# Altium schematic sheet Battery_1CELL.SchDoc
size A4
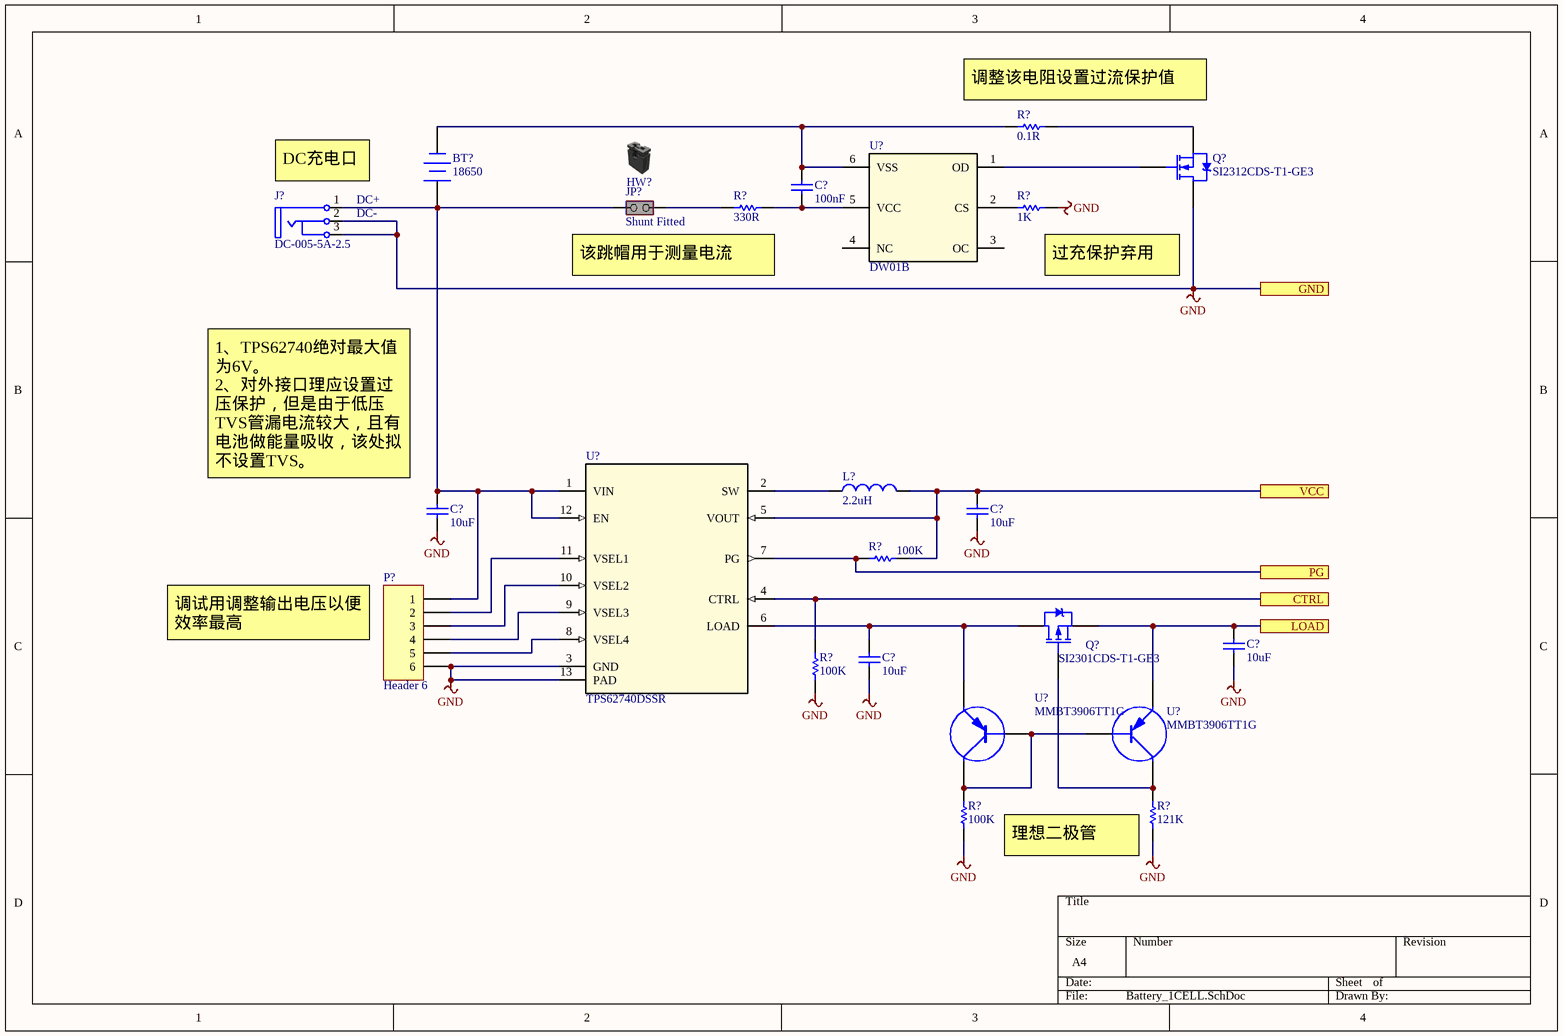
[diagram p0: Battery_1CELL.SchDoc]

## Parts
(Parts that share a designator on the sheet are numbered #1, #2 ... from top to bottom, then left to right.)
BT?  18650  [DIP-18650]
C?#1  100nF  [S0603C]
C?#2  10uF  [S0805C]
C?#3  10uF  [S0805C]
C?#4  10uF  [S0805C]
C?#5  10uF  [S0805C]
HW?  SHUNT  (value not drawn)  (mechanical)
J?  DC-005-5A-2.5  [DC-5.5X2.5]
JP?  Shunt Fitted  [CON_SAMTEC_TSW-102-07-G-S]
L?  2.2uH  [S0805L]
P?  Header 6  [CP1X6]
Q?#1  SI2312CDS-T1-GE3  [SOT-23(SOT-23-3)]
Q?#2  SI2301CDS-T1-GE3  [SOT-23(SOT-23-3)]
R?#1  0.1R  [S0805R]
R?#2  330R  [S0603R]
R?#3  1K  [S0603R]
R?#4  100K  [S0603R]
R?#5  100K  [S0603R]
R?#6  100K  [S0603R]
R?#7  121K  [S0603R]
U?#1  DW01B  [USOT23-6]
U?#2  TPS62740DSSR  [DSS0012A]
U?#3  MMBT3906TT1G  [SOT-23(SOT-23-3)]
U?#4  MMBT3906TT1G  [SOT-23(SOT-23-3)]

## Ports
CTRL, GND, LOAD, PG, VCC

## Nets
GND: C?#2.1 C?#3.1 C?#4.1 C?#5.1 J?.2(DC-) J?.3(DC-) P?.6 Q?#1.3(D) R?#3.2 R?#5.1 R?#6.1 R?#7.1 U?#2.3(GND) U?#2.13(PAD) ; port GND
CTRL: R?#5.2 U?#2.4(CTRL) ; port CTRL
LOAD: C?#4.2 Q?#2.2(S) U?#4.2(E) ; port LOAD
PG: R?#4.1 U?#2.7(PG) ; port PG
VCC: C?#3.2 L?.2 R?#4.2 U?#2.5(VOUT) ; port VCC
NetBT?_1: BT?.1(+) C?#2.2 J?.1(DC+) JP?.1(COMMON) P?.1 U?#2.1(VIN) U?#2.12(EN)
NetBT?_2: BT?.2(-) C?#1.1 R?#1.1 U?#1.6(VSS)
NetC?#1_2: C?#1.2 R?#2.2 U?#1.5(VCC)
NetC?#5_2: C?#5.2 Q?#2.3(D) U?#2.6(LOAD) U?#3.2(E)
NetJP?_2: JP?.2(NO) R?#2.1
NetL?_1: L?.1 U?#2.2(SW)
NetP?_2: P?.2 U?#2.11(VSEL1)
NetP?_3: P?.3 U?#2.10(VSEL2)
NetP?_4: P?.4 U?#2.9(VSEL3)
NetP?_5: P?.5 U?#2.8(VSEL4)
NetQ?#1_1: Q?#1.1(G) U?#1.1(OD)
NetQ?#1_2: Q?#1.2(S) R?#1.2
NetQ?#2_1: Q?#2.1(G) R?#7.2 U?#4.3(C)
NetR?#3_1: R?#3.1 U?#1.2(CS)
NetR?#6_2: R?#6.2 U?#3.1(B) U?#3.3(C) U?#4.1(B)

Not connected (* = marked no-connect by the designer): U?#1 3(OC) 4(NC)

## Notes on the sheet
- (near R?#1) 调整该电阻设置过流保护值
- (near J?) DC充电口
- (near J?) DC+
- (near J?) DC-
- 该跳帽用于测量电流
- (near R?#3) 过充保护弃用
- (near C?#2) 1、TPS62740绝对最大值为6V。
  2、对外接口理应设置过压保护，但是由于低压TVS管漏电流较大，且有电池做能量吸收，该处拟不设置TVS。
- 调试用调整输出电压以便效率最高
- (near R?#7) 理想二极管

## Library data of the parts
BT? = Battery_18650_DIP: 18650单节直插电池仓; CompType: 电池盒/电池座; Code: DIP-18650; DistributorCode: -; Manufacturer: -; Package: DIP; A_Code: -; A_ComType: -; A_Manufacturer: -
C?#1 = 100nF/0603/50V: 精度 ±10% / 容值 100nF / 额定电压 50V / 温漂系数（介质材料) X7R; Manufacturer: FH(风华); A_Manufacturer: 元六; Code: 0603B104K500NT; A_Code: J CT41-0603-2R1-50V-104K; CompType: Capacitor; A_ComType: 二类电容; DistributorCode: C30926; Package: 0603
C?#2-C?#5 = 10uF/0805/16V: 精度 ±10% / 容值 10uF / 额定电压 16V / 温漂系数（介质材料) X7R; Manufacturer: FH(风华); A_Manufacturer: 元六; Code: 0805B106K160NT; CompType: Capacitor; A_Code: J CT41-0805-2R2-16V-106M; A_ComType: 二类电容; Package: 0805; DistributorCode: C92341
HW? = SHUNT: SHUNT 2.54mm BLACK; Internal_Part_Number: MCD-00043; Manufacturer_Part_Number: SNT-100-BK-G; Manufacturer: SAMTEC; Part_Type: Mechanical; Provided_By: Subcon; Initial_Board_Reference: MB1274; ECCN_US: n/a; ECCN_EU: n/a; ComponentLink1Description: Samtec_Shunt_Jumper_SNT100.pdf; Status: Released; ComponentLink1URL: http://tunmcdsvn.tun.st.com/Component_Datasheet_Library/Trunk/Connectors/Samtec_Shunt_Jumper_SNT100
J? = DC-005-5A-2.5: 连接器类型 插孔 / 触点外径 6.5mm / 安装特性 - / 电流额定值 5A / 产品类型 DC电源插座 / 公母 公头 / 安装类型 通孔，直角 / 触点内径 2.5mm / 电压额定值 24V; Manufacturer: XKB Connectivity(中国星坤); CompType: 连接器; Code: DC-005-5A-2.5; DistributorCode: C381115; Package: DC电源插座; A_Code: -; A_ComType: -; A_Manufacturer: -
JP? = MCD-00683: Header, 2x1, 2,54mm, VR, TH, Height 5.84mm/2.54mm - Shunt Fitted by default; Part_Type: Connector; Manufacturer_Part_Number: TSW-102-07-x-S; Manufacturer: SAMTEC; Provided_By: Subcon; Initial_Board_Reference: MB1331; Internal_Part_Number: MCD-00683; Status: Released; ComponentLink1Description: Samtec_connector_TSW-HTSW-series.pdf; ComponentLink1URL: http://tunmcdsvn.tun.st.com/Component_Datasheet_Library/Trunk/Connectors/Samtec_TSW-HTSW-series; ECCN_US: n/a; ECCN_EU: n/a; Value: Shunt Fitted
L? = 2.2uH/0805: 精度 ±20% / 额定电流 800mA / 直流电阻（内阻） 230mΩ / 电感值 2.2uH; Manufacturer: TDK; A_Manufacturer: 振华富; Code: MLP2012S2R2MT0S1; A_Code: PI2012F2R2; CompType: Inductor; DistributorCode: C107322; Package: 0805; A_ComType: -
P? = Header 6: Header, 6-Pin; LatestRevisionDate: 17-Jul-2002; LatestRevisionNote: Re-released for DXP Platform.; Publisher: Altium Limited
Q?#1 = SI2312CDS-T1-GE3: 漏源电压（Vdss） 20V / 连续漏极电流（Id）（25°C 时） 6A(Tc) / 栅源极阈值电压 1V @ 250uA / 漏源导通电阻 31.8mΩ @ 5A,4.5V / 最大功率耗散（Ta=25°C） 2.1W(Tc) / 类型 N沟道; Manufacturer: VISHAY(威世); CompType: MOS(场效应管); A_Code: -; A_Manufacturer: -; Code: SI2312CDS-T1-GE3; DistributorCode: C142518; Package: SOT-23-3; A_ComType: -
Q?#2 = SI2301CDS-T1-GE3: 漏源电压（Vdss） -20V / 连续漏极电流（Id）（25°C 时） 3.1A / 栅源极阈值电压 1V @ 250uA / 漏源导通电阻 112mΩ @ 2.8A,4.5V / 最大功率耗散（Ta=25°C） 860mW / 类型 P沟道; Manufacturer: VISHAY(威世); CompType: MOS(场效应管); A_Code: -; A_Manufacturer: -; Code: SI2301CDS-T1-GE3; DistributorCode: C10487; Package: SOT-23-3; A_ComType: -
R?#1 = 0.1R/0805: 阻值（欧姆） 0.1Ω / 精度 ±1% / 功率 1/3W / 温度系数 ±100ppm/°C; Manufacturer: UNI-ROYAL(厚声); A_Manufacturer: 718; Code: HP05W3F100LT5E; A_Code: J-RM2012(0805)-K-B-0.1R-F; CompType: Resistor; A_ComType: RM型片式膜固定电阻器; DistributorCode: C270842; Package: 0805
R?#2 = 330R/0603: 精度 ±1% / 温度系数 ±100ppm/℃ / 阻值 330Ω / 功率 0.1W; Manufacturer: FH(风华); A_Manufacturer: 718; Code: RS-03K3300FT; A_Code: J-RM1608(0603)-K-B-330R-F; CompType: Resistor; A_ComType: RM型片式膜固定电阻器; DistributorCode: C125768; Package: 0603
R?#3 = 1K/0603: 精度 ±1% / 温度系数 ±100ppm/℃ / 阻值 1kΩ / 功率 0.1W; Manufacturer: FH(风华); A_Manufacturer: 718; Code: RS-03K1001FT; A_Code: J-RM1608(0603)-K-B-1K-F; CompType: Resistor; A_ComType: RM型片式膜固定电阻器; DistributorCode: C115325; Package: 0603
R?#4-R?#6 = 100K/0603: 精度 ±1% / 阻值 100kΩ / 温度系数 ±100ppm/℃ / 功率 0.1W; Manufacturer: FH(风华); A_Manufacturer: 718; Code: RS-03K1003FT; A_Code: J-RM1608(0603)-K-B-100K-F; CompType: Resistor; A_ComType: RM型片式膜固定电阻器; DistributorCode: C115320; Package: 0603
R?#7 = 121K/0603: 精度 ±1% / 阻值 121kΩ / 温度系数 ±100ppm/℃ / 功率 0.1W; Manufacturer: FH(风华); A_Manufacturer: 718; Code: RS-03K1213FT; A_Code: J-RM1608(0603)-K-B-121K-F; CompType: Resistor; DistributorCode: C321700; Package: 0603
U?#1 = DW01B: Manufacturer: BLUE ROCKET(蓝箭); CompType: 电池保护芯片; Code: DW01B; DistributorCode: C305480; Package: SOT23-6
U?#2 = TPS62740DSSR: DCDC; Manufacturer: TI(德州仪器); CompType: 电源芯片; DistributorCode: C128606; Package: DSS0012A; Code: TPS62740DSSR
U?#3 U?#4 = MMBT3906TT1G: 额定功率 200mW / 集电极电流Ic 200mA / 集射极击穿电压Vce 40V / 晶体管类型 PNP; Manufacturer: ON(安森美); Code: MMBT3906TT1G; DistributorCode: C82042; Package: SOT23-3; CompType: PNP